# EAGLE design Schematic (EAGLE 7.6.0)
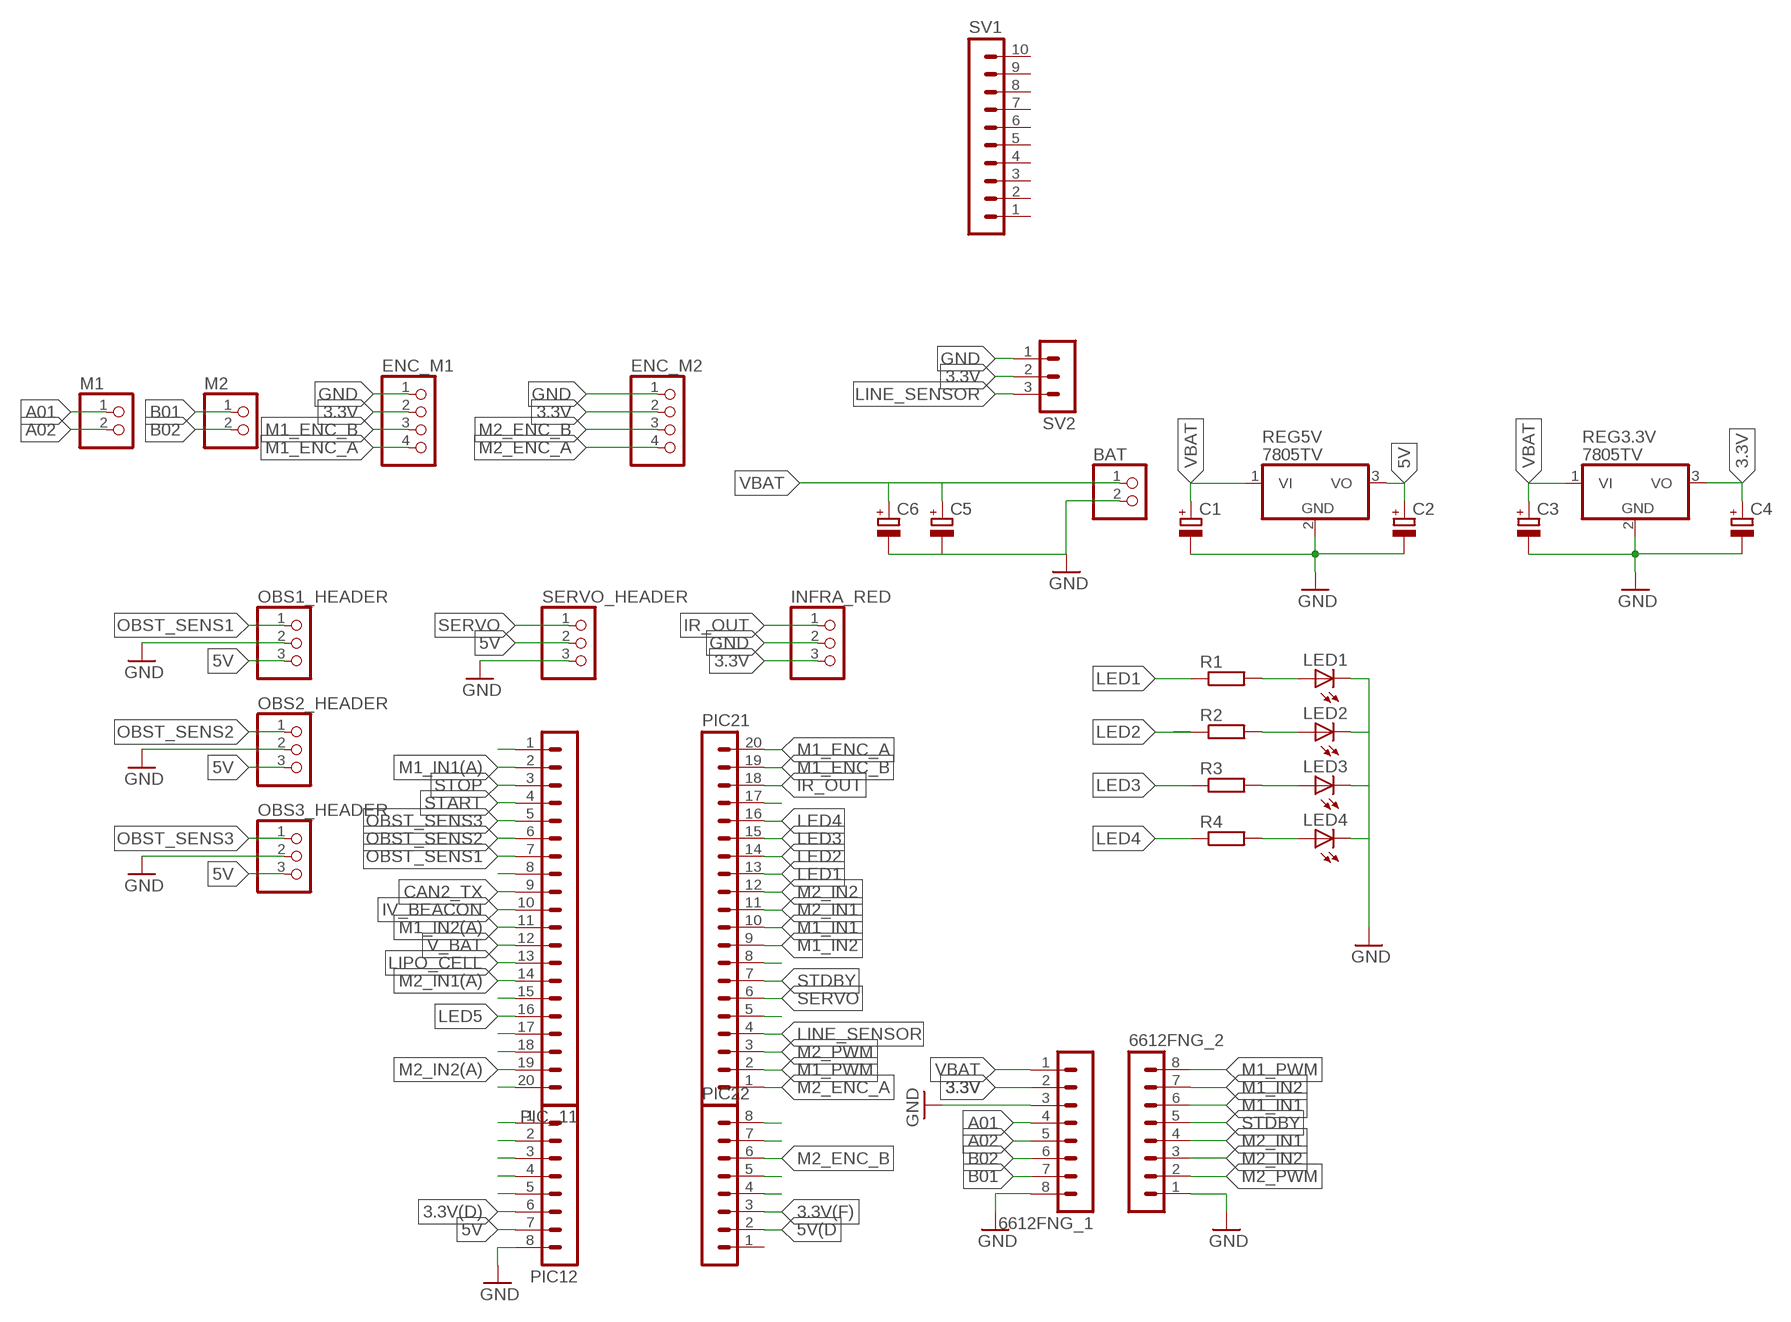
[diagram p0: schematic, sheet 1]

## Parts
6612FNG_1  MA08-1  [MA08-1]
6612FNG_2  MA08-1  [MA08-1]
BAT  PINHD-1X2  [1X02]
C1  CPOL-EUE2,5-6E  [E2,5-6E]
C2  CPOL-EUE2,5-6E  [E2,5-6E]
C3  CPOL-EUE2,5-6E  [E2,5-6E]
C4  CPOL-EUE2,5-6E  [E2,5-6E]
C5  CPOL-EUE2,5-6E  [E2,5-6E]
C6  CPOL-EUE2,5-6E  [E2,5-6E]
ENC_M1  PINHD-1X4  [1X04]
ENC_M2  PINHD-1X4  [1X04]
INFRA_RED  PINHD-1X3  [1X03]
LED1  LED3MM  [LED3MM]
LED2  LED3MM  [LED3MM]
LED3  LED3MM  [LED3MM]
LED4  LED3MM  [LED3MM]
M1  PINHD-1X2  [1X02]
M2  PINHD-1X2  [1X02]
OBS1_HEADER  PINHD-1X3  [1X03]
OBS2_HEADER  PINHD-1X3  [1X03]
OBS3_HEADER  PINHD-1X3  [1X03]
PIC12  MA08-1  [MA08-1]
PIC21  MA20-1  [MA20-1]
PIC22  MA08-1  [MA08-1]
PIC_11  MA20-1  [MA20-1]
R1  R-EU_0207/7  [0207/7]
R2  R-EU_0207/7  [0207/7]
R3  R-EU_0207/7  [0207/7]
R4  R-EU_0207/7  [0207/7]
REG3.3V  7805TV  [TO220V]
REG5V  7805TV  [TO220V]
SERVO_HEADER  PINHD-1X3  [1X03]
SV1  MA10-1  [MA10-1]
SV2  MA03-1  [MA03-1]

## Nets
3.3V: 6612FNG_1.2 C4.+ ENC_M1.2 ENC_M2.2 INFRA_RED.3 REG3.3V.3(VO) SV2.2
3.3V(D): PIC12.6
3.3V(F): PIC22.3
5V: C2.+ OBS1_HEADER.3 OBS2_HEADER.3 OBS3_HEADER.3 PIC12.7 REG5V.3(VO) SERVO_HEADER.2
5V(D: PIC22.2
A01: 6612FNG_1.4 M1.1
A02: 6612FNG_1.5 M1.2
B01: 6612FNG_1.7 M2.1
B02: 6612FNG_1.6 M2.2
CAN1_RX: PIC_11.17
CAN1_TX: PIC_11.18
CAN2_RX: PIC_11.15
CAN2_TX: PIC_11.9
DIR_485: PIC21.17
GND: 6612FNG_1.3 6612FNG_1.8 6612FNG_2.1 BAT.2 C1.- C2.- C3.- C4.- C5.- C6.- ENC_M1.1 ENC_M2.1 INFRA_RED.2 LED1.K(C) LED2.K(C) LED3.K(C) LED4.K(C) OBS1_HEADER.2 OBS2_HEADER.2 OBS3_HEADER.2 PIC12.8 REG3.3V.2(GND) REG5V.2(GND) SERVO_HEADER.3 SV2.1
I2C_SCL: PIC22.8
I2C_SDA: PIC22.7
IO2_U1TX: PIC21.5
IO4: PIC21.8
IR_OUT: INFRA_RED.1 PIC21.18
IV_BEACON: PIC_11.10
LED1: PIC21.13 R1.1
LED2: PIC21.14 R2.1
LED3: PIC21.15 R3.1
LED4: PIC21.16 R4.1
LED5: PIC_11.16
LINE_SENSOR: PIC21.4 SV2.3
LIPO_CELL: PIC_11.13
M1_ENC_A: ENC_M1.4 PIC21.20
M1_ENC_B: ENC_M1.3 PIC21.19
M1_IN1: 6612FNG_2.6 PIC21.10
M1_IN1(A): PIC_11.2
M1_IN2: 6612FNG_2.7 PIC21.9
M1_IN2(A): PIC_11.11
M1_PWM: 6612FNG_2.8 PIC21.2
M2_ENC_A: ENC_M2.4 PIC21.1
M2_ENC_B: ENC_M2.3 PIC22.6
M2_IN1: 6612FNG_2.4 PIC21.11
M2_IN1(A): PIC_11.14
M2_IN2: 6612FNG_2.3 PIC21.12
M2_IN2(A): PIC_11.19
M2_PWM: 6612FNG_2.2 PIC21.3
N$1: LED1.A R1.2
N$2: LED2.A R2.2
N$3: LED3.A R3.2
N$4: LED4.A R4.2
N$8: PIC22.5
N$53: PIC12.2
N$54: PIC12.3
N$55: PIC12.4
N$56: PIC12.5
OBST_SENS1: OBS1_HEADER.1 PIC_11.7
OBST_SENS2: OBS2_HEADER.1 PIC_11.6
OBST_SENS3: OBS3_HEADER.1 PIC_11.5
PGC: PIC_11.1
PGD: PIC_11.8
SERVO: PIC21.6 SERVO_HEADER.1
START: PIC_11.4
STDBY: 6612FNG_2.5 PIC21.7
STOP: PIC_11.3
U2_RC: PIC_11.20
U2_TX: PIC12.1
U6_TX: PIC22.4
V_BAT: PIC_11.12
VBAT: 6612FNG_1.1 BAT.1 C1.+ C3.+ C5.+ C6.+ REG3.3V.1(VI) REG5V.1(VI)
Unconnected: PIC22.1 SV1.1 SV1.2 SV1.3 SV1.4 SV1.5 SV1.6 SV1.7 SV1.8 SV1.9 SV1.10

## Library data of the parts
6612FNG_1 6612FNG_2 PIC12 PIC22 = con-lstb:MA08-1: PIN HEADER; OC_FARNELL: unknown; OC_NEWARK: unknown
BAT M1 M2 = pinhead:PINHD-1X2: PIN HEADER
C1-C6 = resistor:CPOL-EU: POLARIZED CAPACITOR, European symbol
ENC_M1 ENC_M2 = pinhead:PINHD-1X4: PIN HEADER
INFRA_RED OBS1_HEADER OBS2_HEADER OBS3_HEADER SERVO_HEADER = pinhead:PINHD-1X3: PIN HEADER
LED1-LED4 = led:LED: LED OSRAM: - CHIPLED LG R971, LG N971, LY N971, LG Q971, LY Q971, LO R971, LY R971 LH N974, LH R974 LS Q976, LO Q976, LY Q976 LO Q996 - Hyper CHIPLED LW Q18S LB Q993, LB Q99A, LB R99A - SideLED LS A670, LO A670, LY A670, LG A670, LP A670 LB A673, LV A673, LT A673, LW A673 LH A674 LY A675 LS A676, LA A676, LO A676, LY A676, LW A676 LS A679, LY A679, LG A679 - Hyper Micro SIDELED® LS Y876, LA Y876, LO Y876, LY Y876 LT Y87S - SmartLED LW L88C, LW L88S LB L89C, LB L89S, LG L890 LS L89K, LO L89K, LY L89K LS L896, LA L896, LO L896, LY L896 - TOPLED LS T670, LO T670, LY T670, LG T670, LP T670 LSG T670, LSP T670, LSY T670, LOP T670, LYG T670 LG T671, LOG T671, LSG T671 LB T673, LV T673, LT T673, LW T673 LH T674 LS T676, LA T676, LO T676, LY T676, LB T676, LH T676, LSB T676, LW T676 LB T67C, LV T67C, LT T67C, LS T67K, LO T67K, LY T67K, LW E67C LS E67B, LA E67B, LO E67B, LY E67B, LB E67C, LV E67C, LT E67C LW T67C LS T679, LY T679, LG T679 LS T770, LO T770, LY T770, LG T770, LP T770 LB T773, LV T773, LT T773, LW T773 LH T774 LS E675, LA E675, LY E675, LS T675 LS T776, LA T776, LO T776, LY T776, LB T776 LHGB T686 LT T68C, LB T68C - Hyper Mini TOPLED® LB M676 - Mini TOPLED Santana® LG M470 LS M47K, LO M47K, LY M47K Source: http://www.osram.convergy.de LUXEON: - LUMILED® LXK2-PW12-R00, LXK2-PW12-S00, LXK2-PW14-U00, LXK2-PW14-V00 LXK2-PM12-R00, LXK2-PM12-S00, LXK2-PM14-U00 LXK2-PE12-Q00, LXK2-PE12-R00, LXK2-PE12-S00, LXK2-PE14-T00, LXK2-PE14-U00 LXK2-PB12-K00, LXK2-PB12-L00, LXK2-PB12-M00, LXK2-PB14-N00, LXK2-PB14-P00, LXK2-PB14-Q00 LXK2-PR12-L00, LXK2-PR12-M00, LXK2-PR14-Q00, LXK2-PR14-R00 LXK2-PD12-Q00, LXK2-PD12-R00, LXK2-PD12-S00 LXK2-PH12-R00, LXK2-PH12-S00 LXK2-PL12-P00, LXK2-PL12-Q00, LXK2-PL12-R00 Source: www.luxeon.com KINGBRIGHT: KA-3528ASYC Source: www.kingbright.com
PIC21 PIC_11 = con-lstb:MA20-1: PIN HEADER; OC_FARNELL: unknown; OC_NEWARK: unknown
R1-R4 = resistor:R-EU_: RESISTOR, European symbol
REG3.3V REG5V = linear:78*: Positive VOLTAGE REGULATOR Source: http://cache.national.com/ds/LM/LM78L05.pdf http://www.fairchildsemi.com/ds/LM/LM7805.pdf
SV1 = con-lstb:MA10-1: PIN HEADER; OC_FARNELL: unknown; OC_NEWARK: unknown
SV2 = con-lstb:MA03-1: PIN HEADER; OC_FARNELL: unknown; OC_NEWARK: unknown

## Board
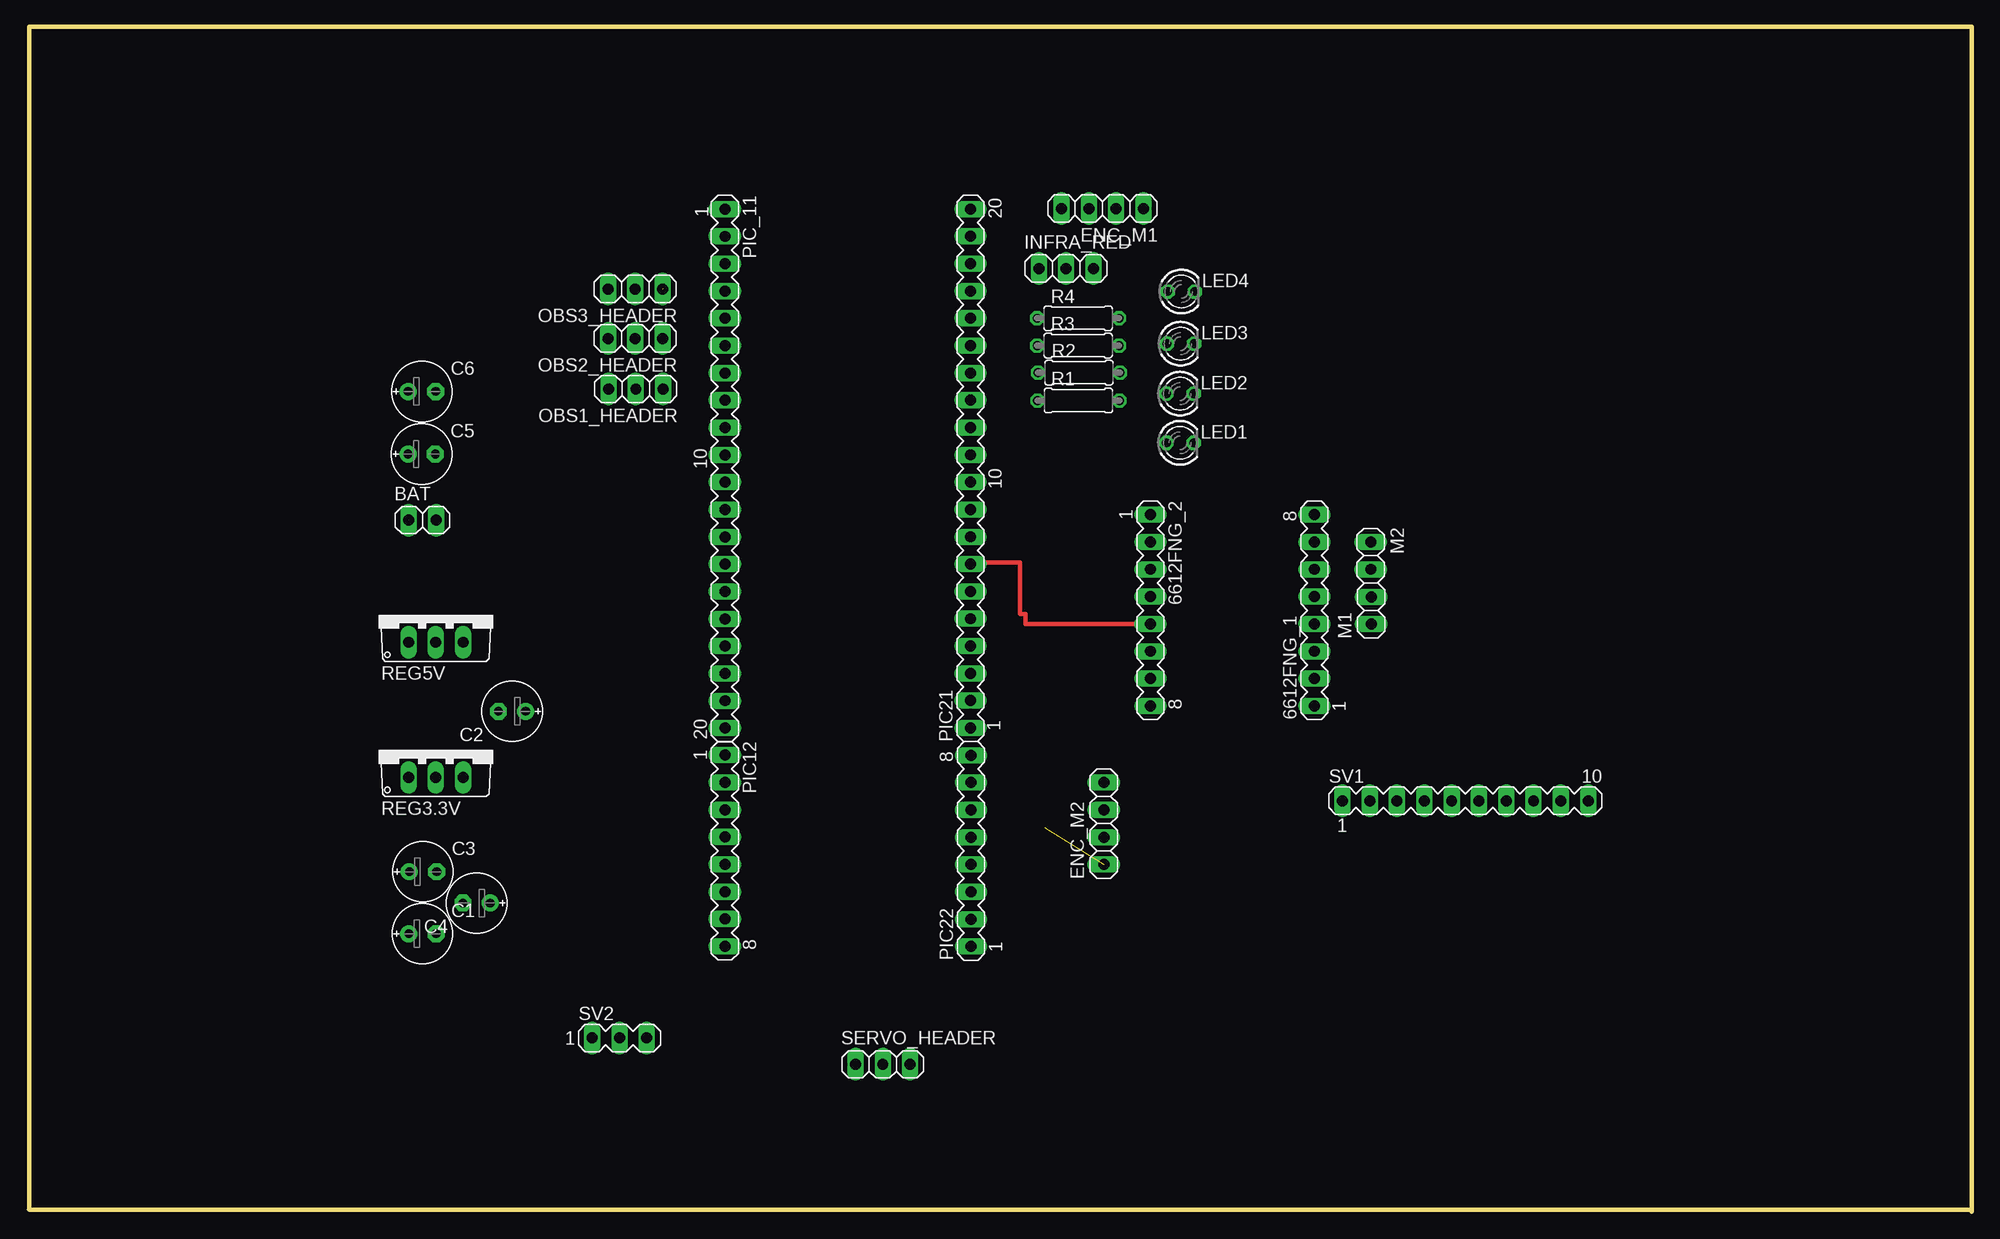
[diagram p1: board, top side]
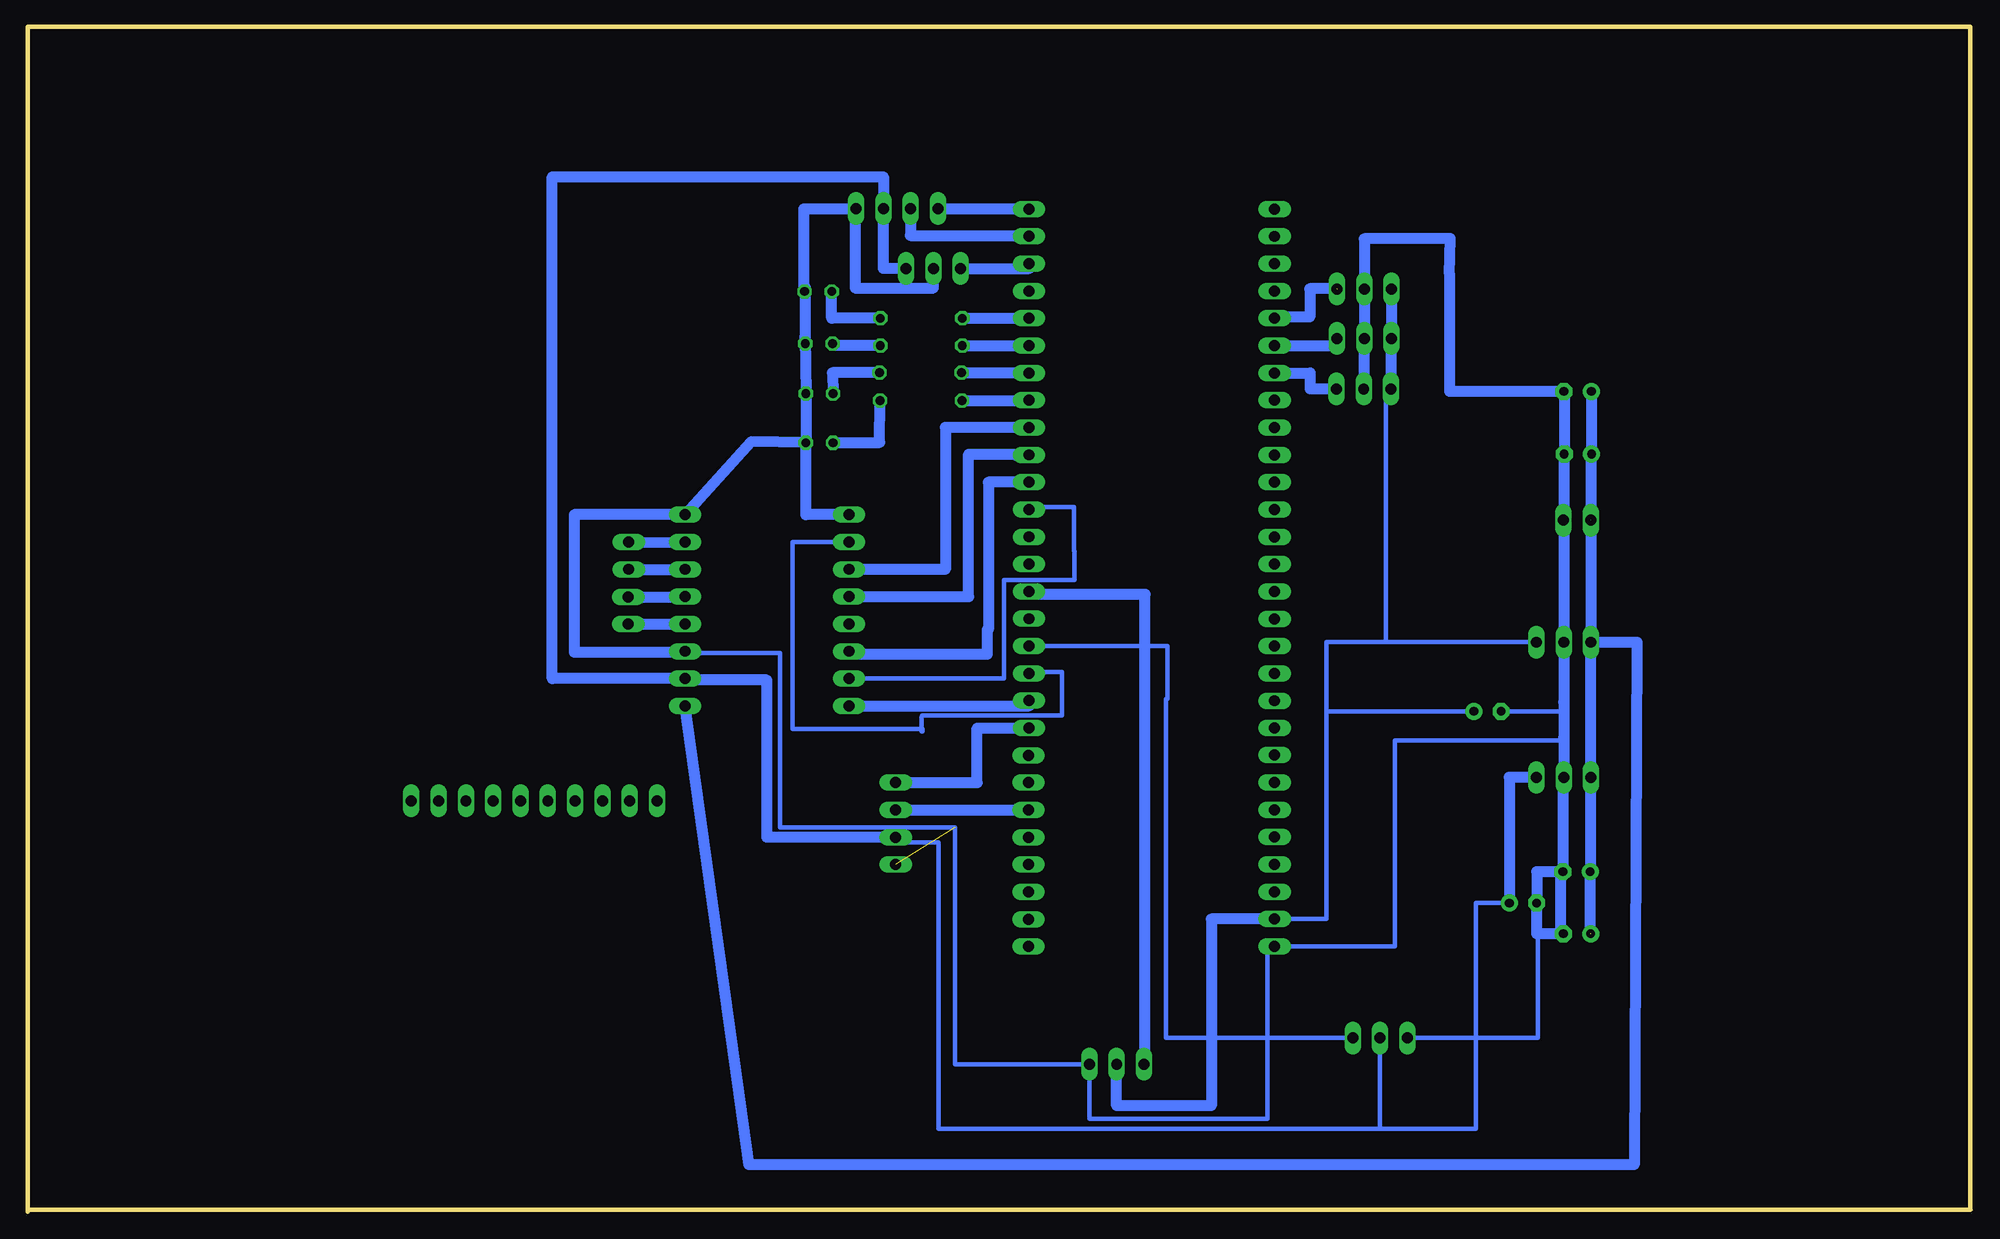
[diagram p2: board, bottom side, seen from below]

Size 180.9 x 110.2 mm. Coordinates in mm from the lower left corner, seen from the top.
Outline: 180.9,0.31 0,0.2
Outline: 180.8,0 180.8,0.2
Outline: 180.8,0.2 180.8,110.2 0.2,110.2 0.2,0.2 180.8,0.2
Copper layers (1*16): Top 0.035mm / dielectric 1.5mm / Bottom 0.035mm
Design rules "default": minimum track width 10mil, minimum drill 24mil, track to track 8mil, track to pad 8mil, pad to pad 8mil, via to via 8mil, smd to smd 8mil, copper to edge 40mil, drill to drill 8mil, minimum pad ring 10mil, minimum via ring 8mil, stop-mask expansion 4mil, vias tented up to drill 0mil, thermal gap 10mil

### Footprints (pad centres in the part's own frame; a part is rotated, then mirrored left to right if it is on the bottom)
MA08-1 = drill 1.016 long: 1 -8.89,0; 2 -6.35,0; 3 -3.81,0; 4 -1.27,0; 5 1.27,0; 6 3.81,0; 7 6.35,0; 8 8.89,0
1X02 = drill 1.016 long: 1 -1.27,0; 2 1.27,0
E2,5-6E = drill 0.813 pad 1.575: + -1.27,0 | drill 0.813 pad 1.575 octagon: - 1.27,0
1X04 = drill 1.016 long: 1 -3.81,0; 2 -1.27,0; 3 1.27,0; 4 3.81,0
1X03 = drill 1.016 long: 1 -2.54,0; 2 0,0; 3 2.54,0
LED3MM = drill 0.813 octagon: A -1.27,0; K 1.27,0
MA20-1 = drill 1.016 long: 1 -24.13,0; 2 -21.59,0; 3 -19.05,0; 4 -16.51,0; 5 -13.97,0; 6 -11.43,0; 7 -8.89,0; 8 -6.35,0; 9 -3.81,0; 10 -1.27,0; 11 1.27,0; 12 3.81,0; 13 6.35,0; 14 8.89,0; 15 11.43,0; 16 13.97,0; 17 16.51,0; 18 19.05,0; 19 21.59,0; 20 24.13,0
0207/7 = drill 0.813 octagon: 1 -3.81,0; 2 3.81,0
TO220V = drill 1.016 long: 1 -2.54,-2.54; 2 0,-2.54; 3 2.54,-2.54
MA10-1 = drill 1.016 long: 1 -11.43,0; 2 -8.89,0; 3 -6.35,0; 4 -3.81,0; 5 -1.27,0; 6 1.27,0; 7 3.81,0; 8 6.35,0; 9 8.89,0; 10 11.43,0
MA03-1 = drill 1.016 long: 1 -2.54,0; 2 0,0; 3 2.54,0

### Placement (x,y rotation side)
6612FNG_1  119.71,55.95 90 top
6612FNG_2  104.47,55.95 270 top
BAT  36.78,64.34 0 top
C1  36.78,25.88 0 top
C2  45.11,46.55 180 top
C3  36.83,31.65 0 top
C4  41.81,28.72 180 top
C5  36.7,70.48 0 top
C6  36.73,76.3 0 top
ENC_M1  100,93.32 180 top
ENC_M2  100.12,36.12 90 top
INFRA_RED  96.62,87.73 0 top
LED1  107.21,71.52 0 top
LED2  107.21,76.1 0 top
LED3  107.26,80.74 0 top
LED4  107.34,85.59 0 top
M1  124.99,55.93 90 top
M2  124.94,61.03 270 top
OBS1_HEADER  56.61,76.53 180 top
OBS2_HEADER  56.56,81.23 180 top
OBS3_HEADER  56.56,85.82 180 top
PIC12  64.9,33.59 270 top
PIC21  87.73,69.14 90 top
PIC22  87.78,33.58 90 top
PIC_11  64.9,69.13 270 top
R1  97.76,75.46 0 top
R2  97.81,78.05 0 top
R3  97.74,80.57 0 top
R4  97.74,83.11 0 top
REG3.3V  38.02,42.95 0 top
REG5V  38.02,55.52 0 top
SERVO_HEADER  79.58,13.74 0 top
SV1  133.73,38.24 0 top
SV2  55.09,16.18 0 top

### Tracks (layer width: path | path; a pad name or v marks a point on that pad's centre or on a via)
3.3V
  Bottom 0.406: ENC_M2.2 100.12,34.39 96.14,34.39 96.14,7.72 55.09,7.72 | C4.+ 46.2,28.72 46.2,7.72 55.09,7.72 | 55.09,7.72 SV2.2
  Bottom 1.016: REG3.3V.3 43.08,40.41 C4.+ | ENC_M2.2 112.09,34.85 112.09,49.45 119.71,49.45 6612FNG_1.2 132.05,49.6 132.05,96.26 101.27,96.26 ENC_M1.2 101.27,87.73 INFRA_RED.3
5V
  Bottom 0.406: REG5V.3 54.56,52.98 | 54.56,52.98 60.09,52.98 60.09,46.55 | 60.09,46.55 60.09,27.25 PIC12.7 | OBS1_HEADER.3 54.56,76.53 54.56,52.98 | C2.+ 60.09,46.55
  Bottom 1.016: OBS3_HEADER.3 OBS2_HEADER.3 54.02,76.53 OBS1_HEADER.3 | 64.9,27.43 PIC12.7 70.79,27.25 70.79,9.88 79.58,9.88 SERVO_HEADER.2
A01
  Bottom 1.016: M1.1 119.71,54.66 6612FNG_1.4
A02
  Bottom 1.016: M1.2 119.71,57.2 6612FNG_1.5
B01
  Bottom 1.016: M2.1 119.71,62.25 6612FNG_1.7
B02
  Bottom 1.016: M2.2 6612FNG_1.6
GND  (1 unrouted)
  Bottom 0.406: C2.- 38.02,46.55 38.02,47.39 | 38.02,44.09 38.02,43.86 53.72,43.86 53.72,24.7 PIC12.8 65.58,24.7 65.58,8.68 82.12,8.68 SERVO_HEADER.3 94.59,13.74 94.59,35.76 110.89,35.76 110.89,51.99 119.71,51.99 6612FNG_1.3 | SV2.1 40.43,16.18 40.43,25.88
  Bottom 1.016: OBS1_HEADER.2 56.61,81.23 OBS2_HEADER.2 OBS3_HEADER.2 56.56,90.5 48.56,90.52 48.64,87.2 48.61,87.2 48.61,76.3 C6.- 37.97,76.3 C5.- 37.97,64.34 BAT.2 38.02,64.34 REG5V.2 38.02,47.39 38.02,44.09 REG3.3V.2 38.1,40.41 C3.- | C1.- 40.43,25.88 40.54,25.88 C4.- 40.54,31.64 C3.- | C3.- 38.33,31.64 38.33,26.03 38.02,26.03 38.02,25.73 | 103.88,93.29 108.66,93.29 108.66,85.98 LED4.K 108.53,85.98 LED3.K 108.56,81.38 LED2.K LED1.K | ENC_M1.1 103.81,93.29 103.88,93.29 | LED1.K 113.56,71.62 6612FNG_1.8 130.02,64.84 130.02,52.07 119.71,52.07 6612FNG_1.3 | 103.88,93.29 103.88,85.92 96.62,85.92 INFRA_RED.2 | 6612FNG_2.1 108.48,64.84 LED1.K
IR_OUT
  Bottom 1.016: INFRA_RED.1 87.73,87.73 PIC21.18
LED1
  Bottom 1.016: R1.1 87.73,75.46 PIC21.13
LED2
  Bottom 1.016: R2.1 87.73,78.05 PIC21.14
LED3
  Bottom 1.016: R3.1 PIC21.15
LED4
  Bottom 1.016: R4.1 PIC21.16
LINE_SENSOR
  Bottom 0.406: SV2.3 74.98,16.18 74.98,47.7 74.85,47.7 74.85,52.65 87.73,52.65 PIC21.4
M1_ENC_A
  Bottom 1.016: ENC_M1.4 87.73,93.32 PIC21.20
M1_ENC_B
  Bottom 1.016: ENC_M1.3 98.75,93.32 98.75,90.8 87.73,90.8 PIC21.19
M1_IN1
  Bottom 1.016: PIC21.10 91.51,67.87 91.51,54.15 91.62,54.15 91.62,51.86 104.47,51.86 6612FNG_2.6
M1_IN2
  Bottom 0.406: 6612FNG_2.7 90.04,49.6 90.04,58.75 83.49,58.75 83.49,61.44 83.56,61.44 83.56,65.55 87.73,65.55 PIC21.9
M1_PWM
  Bottom 1.016: 6612FNG_2.8 87.73,47.06 PIC21.2
M2_ENC_A
  Bottom 1.016: ENC_M2.4 92.55,39.93 92.55,45.01 PIC21.1
M2_ENC_B
  Bottom 1.016: ENC_M2.3 PIC22.6
M2_IN1
  Bottom 1.016: 6612FNG_2.4 93.34,57.22 93.34,70.46 88.8,70.46 88.8,70.28 87.73,70.28 PIC21.11
M2_IN2
  Bottom 1.016: PIC21.12 95.5,72.95 95.5,59.76 6612FNG_2.3
M2_PWM
  Bottom 0.406: 6612FNG_2.2 109.7,62.3 109.7,44.9 97.63,44.9 97.63,44.7 97.74,44.7 97.74,46.02 97.69,46.02 97.69,46.15 84.66,46.15 84.66,50.21 87.73,50.21 PIC21.3
N$1
  Bottom 1.016: LED1.A 101.62,71.55 R1.2
N$2
  Bottom 1.016: R2.2 106.02,78.05 LED2.A
N$3
  Bottom 1.016: R3.2 105.99,80.57 LED3.A
N$4
  Bottom 1.016: 106.07,85.67 LED4.A 106.07,83.11 R4.2
OBST_SENS1
  Bottom 1.016: PIC_11.7 61.57,78.02 61.57,76.53 OBS1_HEADER.1
OBST_SENS2
  Bottom 1.016: PIC_11.6 59.1,80.56 OBS2_HEADER.1
OBST_SENS3  (1 unrouted)
  Bottom 1.016: 59.1,85.85 61.62,85.85 61.62,83.23 64.9,83.23 PIC_11.5
SERVO
  Bottom 1.016: SERVO_HEADER.1 76.93,13.74 76.93,57.43 87.73,57.43 PIC21.6
STDBY
  Top 0.406: 6612FNG_2.5 92.86,54.68 92.86,55.62 92.35,55.62 92.35,60.37 87.73,60.37 PIC21.7
VBAT  (via drill 0.6)  (2 unrouted)
  Bottom 1.016: v35.56,25.88 C3.+ 35.56,40.41 REG3.3V.1 REG5V.1 | 35.48,64.34 REG5V.1 | REG5V.1 31.21,52.98 31.47,4.39 113.76,4.39 6612FNG_1.1 | BAT.1 35.51,70.48 C5.+ 35.43,76.3 C6.+